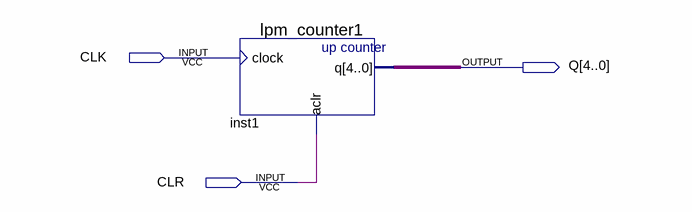
[diagram p0: schematic sheet]
// Quartus schematic cnt4.bdf as structural Verilog: 1 symbols, 3 pins
module cnt4 (
  input  CLK,
  input  CLR,
  output [4:0] Q
);

  lpm_counter1 inst1 (.clock(CLK), .aclr(CLR), .q(Q));
endmodule
